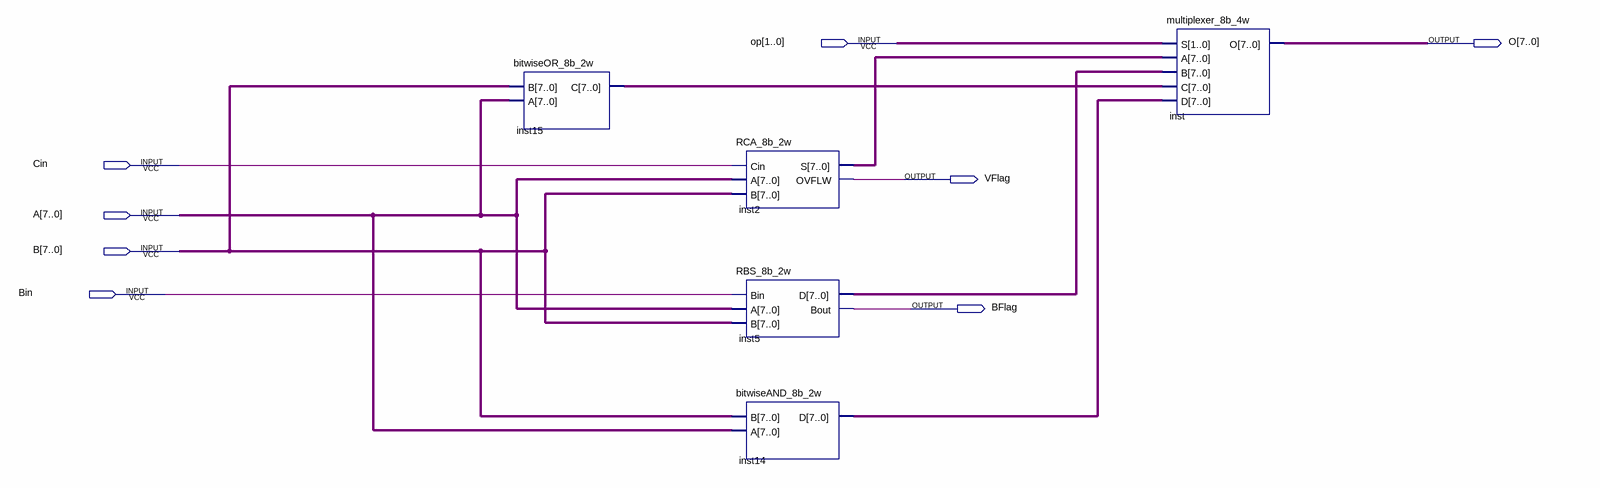
[diagram p0: schematic sheet]
// Quartus schematic ALU_8b_2w.bdf as structural Verilog: 5 symbols, 8 pins
module ALU_8b_2w (
  input  [1:0] op,
  input  Cin,
  input  [7:0] A,
  input  [7:0] B,
  input  Bin,
  output [7:0] O,
  output VFlag,
  output BFlag
);

  wire [7:0] inst2_s, inst5_d, inst14_d, inst15_c;

  bitwiseOR_8b_2w inst15 (.B(B), .A(A), .C(inst15_c));
  RCA_8b_2w inst2 (.Cin(Cin), .A(A), .B(B), .S(inst2_s), .OVFLW(VFlag));
  RBS_8b_2w inst5 (.Bin(Bin), .A(A), .B(B), .D(inst5_d), .Bout(BFlag));
  bitwiseAND_8b_2w inst14 (.B(B), .A(A), .D(inst14_d));
  multiplexer_8b_4w inst (.S(op), .A(inst2_s), .B(inst5_d), .C(inst15_c), .D(inst14_d), .O(O));
endmodule
